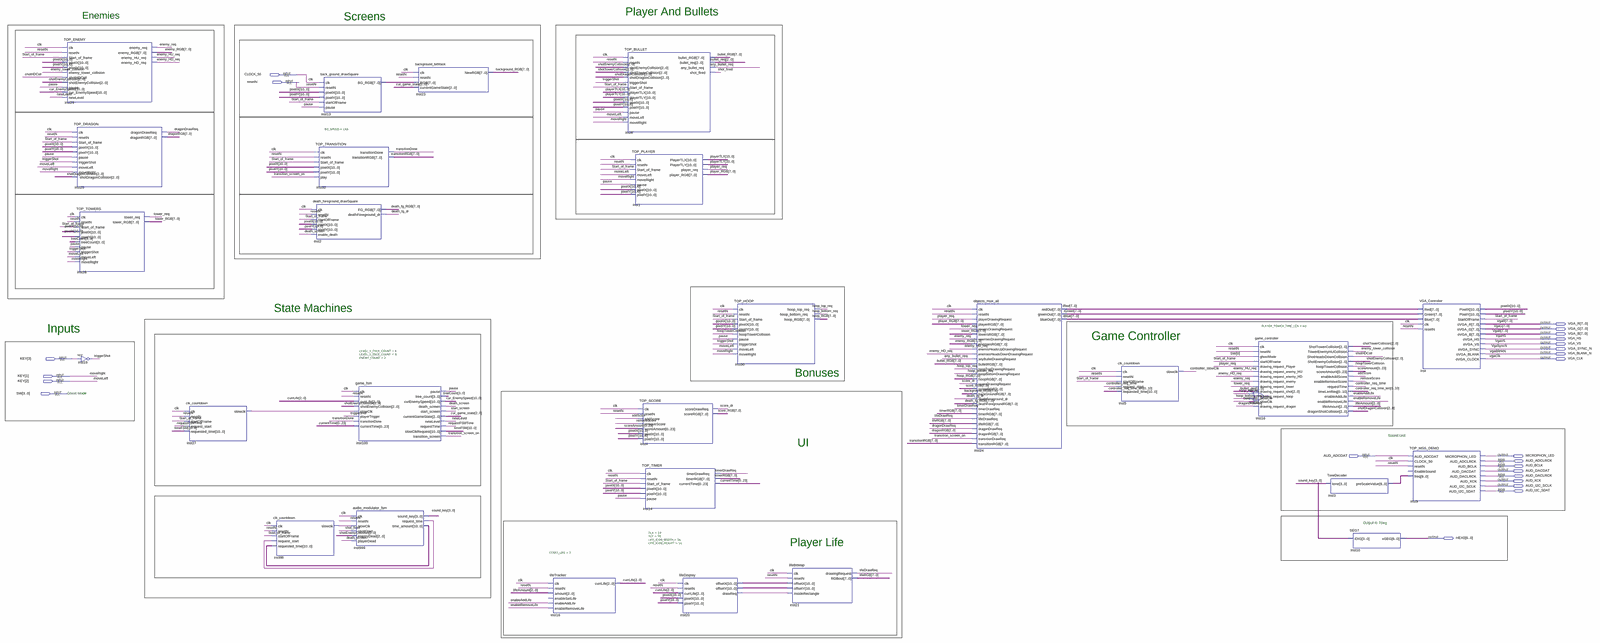
[diagram p0: schematic sheet, whole]
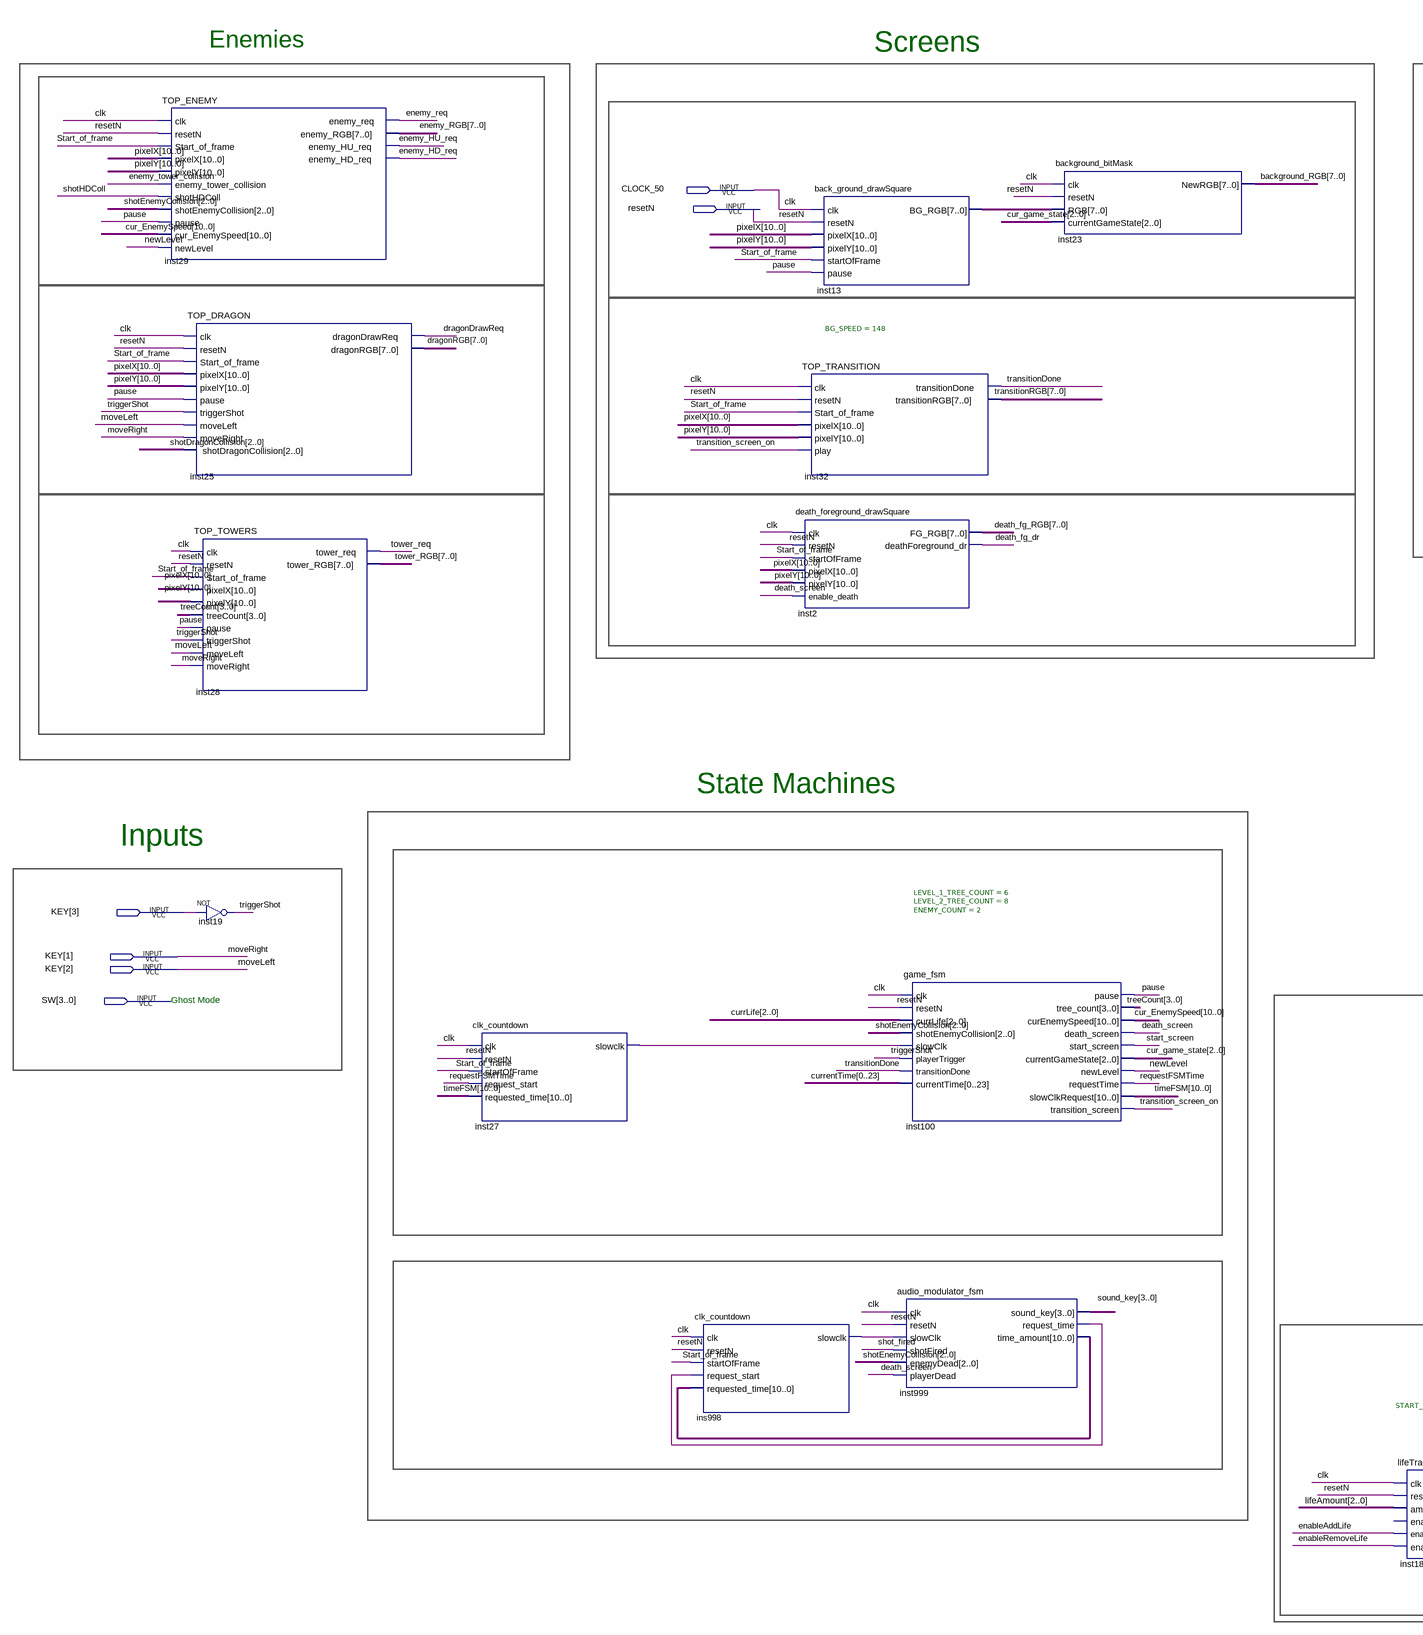
[diagram p1: schematic sheet, left part]
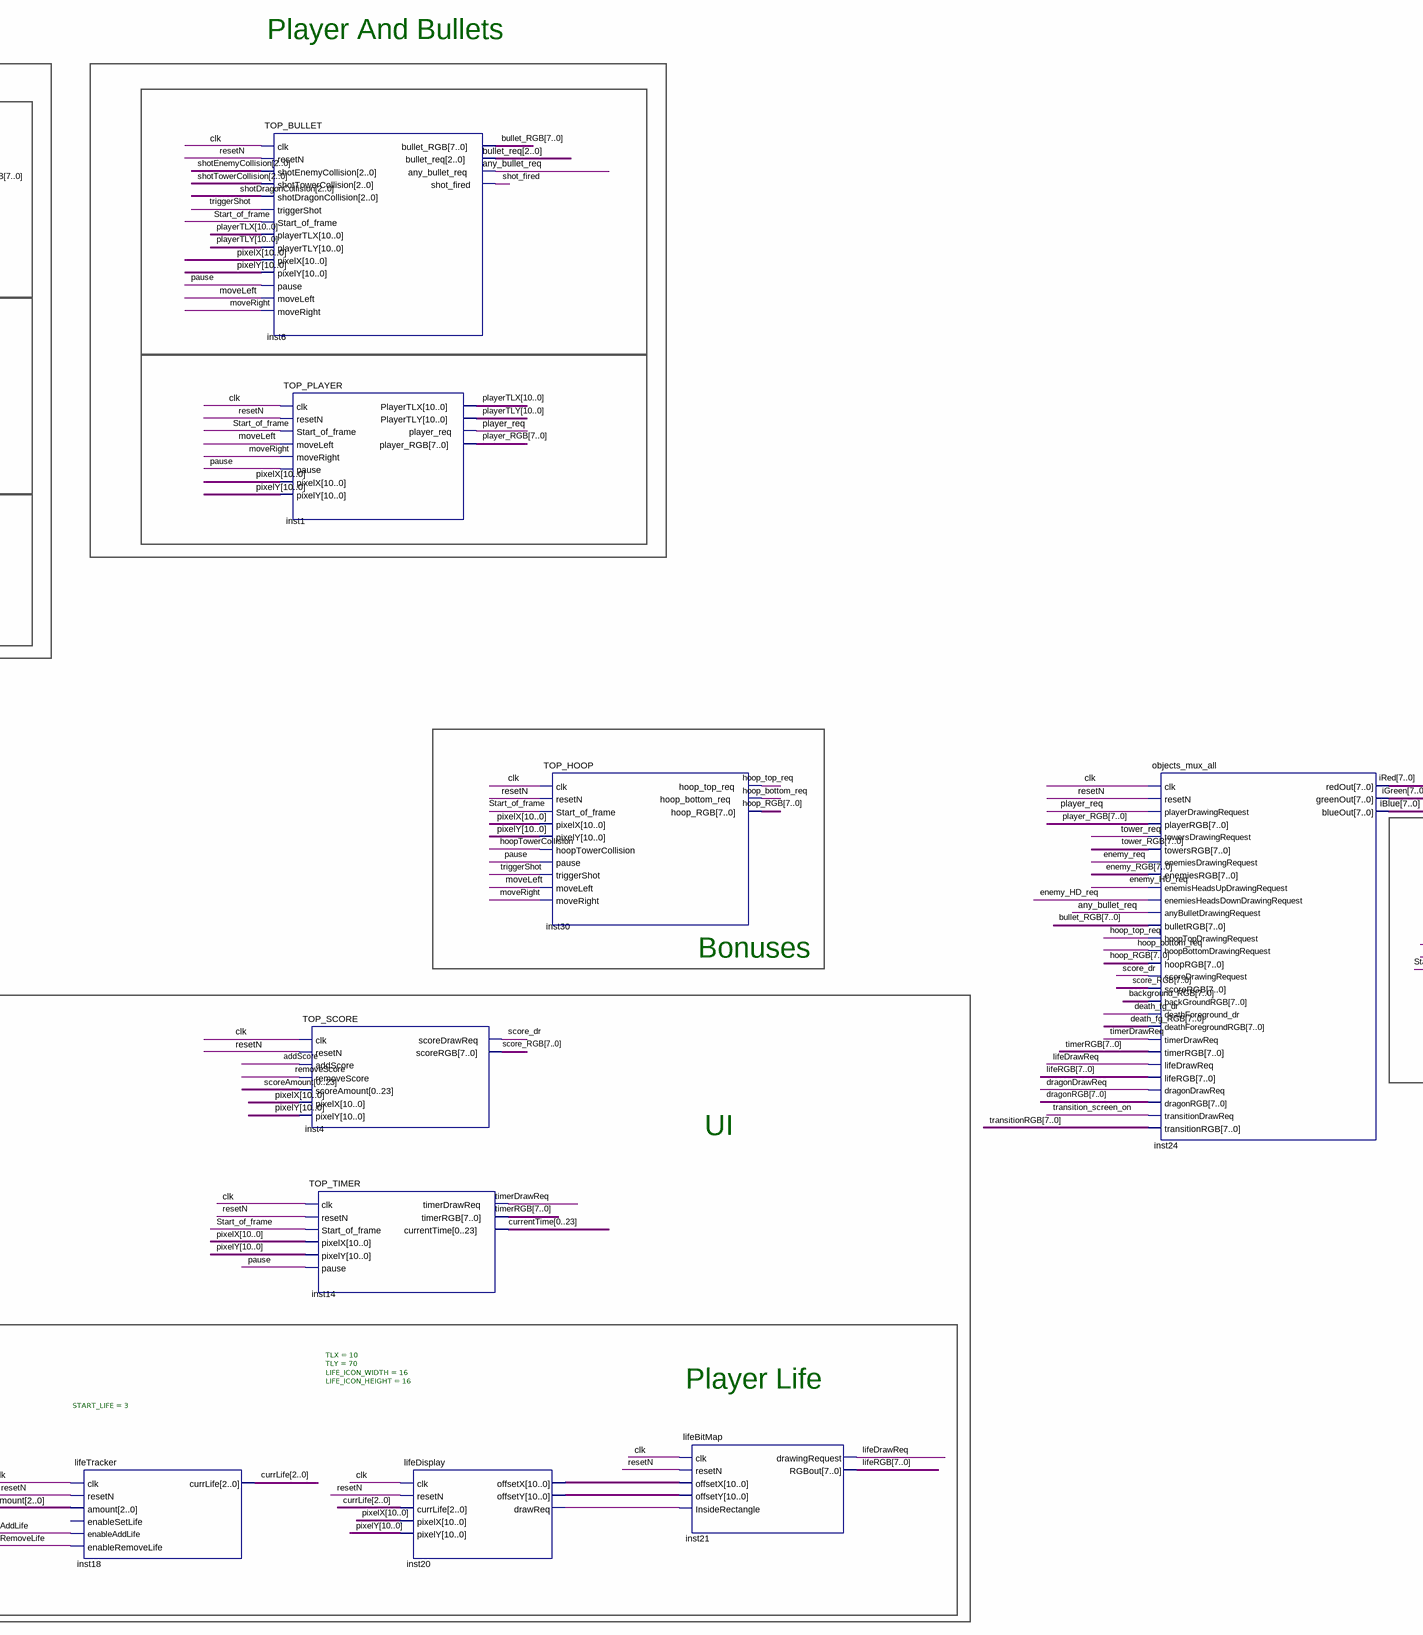
[diagram p2: schematic sheet, centre part]
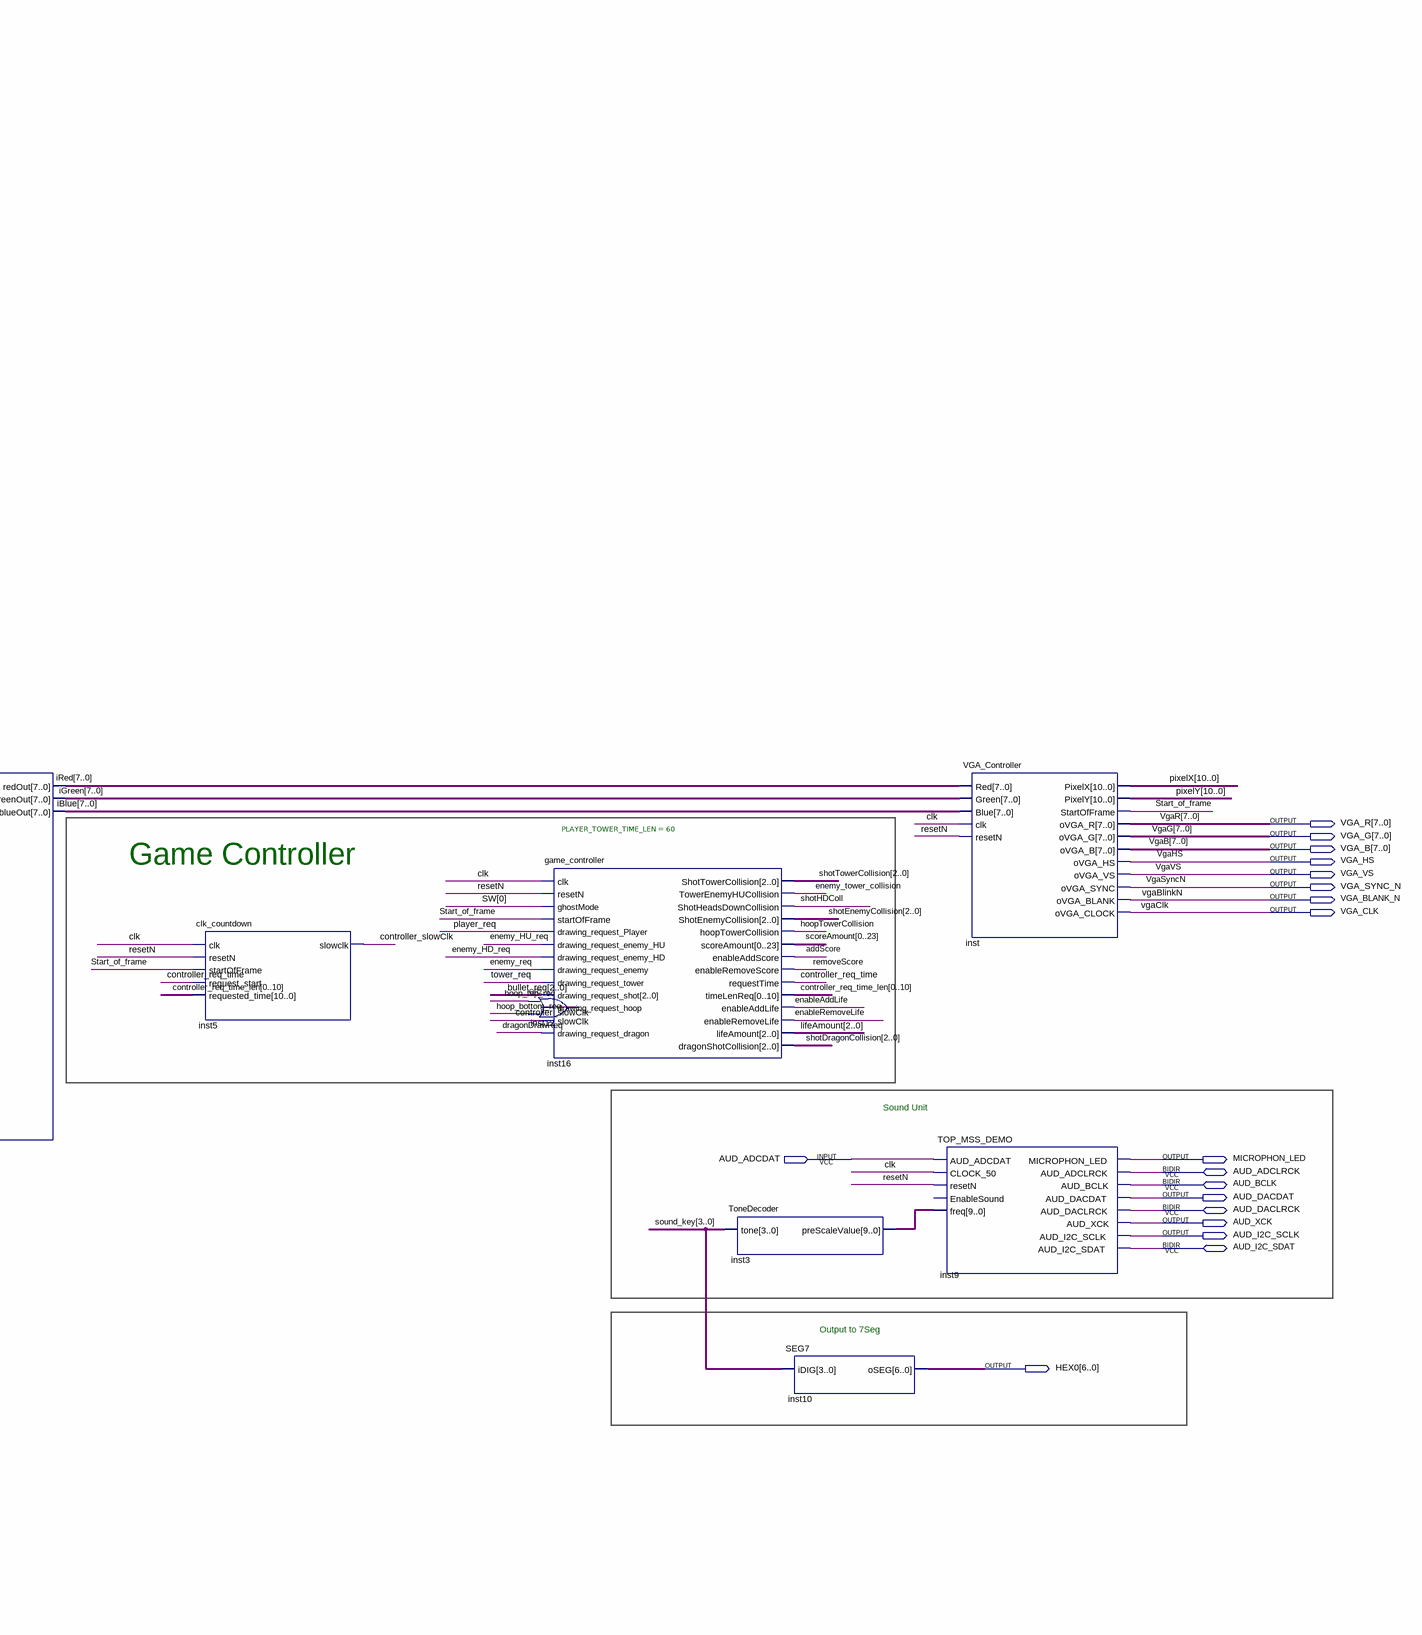
[diagram p3: schematic sheet, right part]
// Quartus schematic TOP_VGA_DEMO_WITH_MSS_ALL.bdf as structural Verilog: 28 symbols, 24 pins
module TOP_VGA_DEMO_WITH_MSS_ALL (
  input  CLOCK_50,
  input  resetN,
  input  [3:1] KEY,
  input  [3:0] SW,
  input  AUD_ADCDAT,
  inout  AUD_ADCLRCK,
  inout  AUD_BCLK,
  inout  AUD_DACLRCK,
  inout  AUD_I2C_SDAT,
  output [7:0] VGA_R,
  output [7:0] VGA_G,
  output [7:0] VGA_B,
  output VGA_HS,
  output VGA_VS,
  output VGA_SYNC_N,
  output VGA_BLANK_N,
  output VGA_CLK,
  output MICROPHON_LED,
  output AUD_DACDAT,
  output AUD_XCK,
  output AUD_I2C_SCLK,
  output [6:0] HEX0
);

  wire addScore, any_bullet_req, controller_req_time, controller_slowClk, death_fg_dr, death_screen,
       dragonDrawReq, enableAddLife, enableRemoveLife, enemy_HD_req, enemy_HU_req, enemy_req,
       enemy_tower_collision, hoop_bottom_req, hoop_top_req, hoopTowerCollision, ins998_slowclk, inst12_out,
       inst20_drawreq, inst27_slowclk, inst999_request_time, lifeDrawReq, newLevel, pause, player_req,
       removeScore, requestFSMTime, score_dr, shot_fired, shotHDColl, Start_of_frame, start_screen,
       timerDrawReq, tower_req, transition_screen_on, transitionDone, triggerShot;
  wire [2:0] bullet_req, cur_game_state, currLife, lifeAmount, shotDragonCollision, shotEnemyCollision,
       shotTowerCollision;
  wire [3:0] sound_key, treeCount;
  wire [7:0] background_RGB, bullet_RGB, death_fg_RGB, dragonRGB, enemy_RGB, hoop_RGB, iBlue, iGreen,
       inst13_bg_rgb, iRed, lifeRGB, player_RGB, score_RGB, timerRGB, tower_RGB, transitionRGB;
  wire [9:0] inst3_prescalevalue;
  wire [10:0] controller_req_time_len, cur_EnemySpeed, inst20_offsetx, inst20_offsety, inst999_time_amount,
       pixelX, pixelY, playerTLX, playerTLY, timeFSM;
  wire [23:0] currentTime, scoreAmount;

  TOP_ENEMY inst29 (
    .clk(CLOCK_50), .resetN(resetN), .Start_of_frame(Start_of_frame), .pixelX(pixelX), .pixelY(pixelY),
    .enemy_tower_collision(enemy_tower_collision), .shotHDColl(shotHDColl),
    .shotEnemyCollision(shotEnemyCollision), .pause(pause), .cur_EnemySpeed(cur_EnemySpeed),
    .newLevel(newLevel), .enemy_req(enemy_req), .enemy_RGB(enemy_RGB), .enemy_HU_req(enemy_HU_req),
    .enemy_HD_req(enemy_HD_req));
  TOP_DRAGON inst25 (
    .clk(CLOCK_50), .resetN(resetN), .Start_of_frame(Start_of_frame), .pixelX(pixelX), .pixelY(pixelY),
    .pause(pause), .triggerShot(triggerShot), .moveLeft(KEY[2]), .moveRight(KEY[1]),
    .shotDragonCollision(shotDragonCollision), .dragonDrawReq(dragonDrawReq), .dragonRGB(dragonRGB));
  TOP_TOWERS inst28 (
    .clk(CLOCK_50), .resetN(resetN), .Start_of_frame(Start_of_frame), .pixelX(pixelX), .pixelY(pixelY),
    .treeCount(treeCount), .pause(pause), .triggerShot(triggerShot), .moveLeft(KEY[2]), .moveRight(KEY[1]),
    .tower_req(tower_req), .tower_RGB(tower_RGB));
  not inst19 (triggerShot, KEY[3]);
  clk_countdown inst27 (
    .clk(CLOCK_50), .resetN(resetN), .startOfFrame(Start_of_frame), .request_start(requestFSMTime),
    .requested_time(timeFSM), .slowclk(inst27_slowclk));
  clk_countdown ins998 (
    .clk(CLOCK_50), .resetN(resetN), .startOfFrame(Start_of_frame), .request_start(inst999_request_time),
    .requested_time(inst999_time_amount), .slowclk(ins998_slowclk));
  back_ground_drawSquare #(.BG_SPEED(148)) inst13 (
    .clk(CLOCK_50), .resetN(resetN), .pixelX(pixelX), .pixelY(pixelY), .startOfFrame(Start_of_frame),
    .pause(pause), .BG_RGB(inst13_bg_rgb));
  TOP_TRANSITION inst32 (
    .clk(CLOCK_50), .resetN(resetN), .Start_of_frame(Start_of_frame), .pixelX(pixelX), .pixelY(pixelY),
    .play(transition_screen_on), .transitionDone(transitionDone), .transitionRGB(transitionRGB));
  death_foreground_drawSquare inst2 (
    .clk(CLOCK_50), .resetN(resetN), .startOfFrame(Start_of_frame), .pixelX(pixelX), .pixelY(pixelY),
    .enable_death(death_screen), .FG_RGB(death_fg_RGB), .deathForeground_dr(death_fg_dr));
  game_fsm #(.LEVEL_1_TREE_COUNT(6), .LEVEL_2_TREE_COUNT(8), .ENEMY_COUNT(2)) inst100 (
    .clk(CLOCK_50), .resetN(resetN), .currLife(currLife), .shotEnemyCollision(shotEnemyCollision),
    .slowClk(inst27_slowclk), .playerTrigger(triggerShot), .transitionDone(transitionDone),
    .currentTime({currentTime[0], currentTime[1], currentTime[2], currentTime[3], currentTime[4], currentTime[5], currentTime[6], currentTime[7], currentTime[8], currentTime[9], currentTime[10], currentTime[11], currentTime[12], currentTime[13], currentTime[14], currentTime[15], currentTime[16], currentTime[17], currentTime[18], currentTime[19], currentTime[20], currentTime[21], currentTime[22], currentTime[23]}),
    .pause(pause), .tree_count(treeCount), .curEnemySpeed(cur_EnemySpeed), .death_screen(death_screen),
    .start_screen(start_screen), .currentGameState(cur_game_state), .newLevel(newLevel),
    .requestTime(requestFSMTime), .slowClkRequest(timeFSM), .transition_screen(transition_screen_on));
  audio_modulator_fsm inst999 (
    .clk(CLOCK_50), .resetN(resetN), .slowClk(ins998_slowclk), .shotFired(shot_fired),
    .enemyDead(shotEnemyCollision), .playerDead(death_screen), .sound_key(sound_key),
    .request_time(inst999_request_time), .time_amount(inst999_time_amount));
  background_bitMask inst23 (
    .clk(CLOCK_50), .resetN(resetN), .RGB(inst13_bg_rgb), .currentGameState(cur_game_state),
    .NewRGB(background_RGB));
  lifeTracker #(.START_LIFE(3)) inst18 (
    .clk(CLOCK_50), .resetN(resetN), .amount(lifeAmount), .enableAddLife(enableAddLife),
    .enableRemoveLife(enableRemoveLife), .currLife(currLife));  // open: enableSetLife
  TOP_BULLET inst6 (
    .clk(CLOCK_50), .resetN(resetN), .shotEnemyCollision(shotEnemyCollision),
    .shotTowerCollision(shotTowerCollision), .shotDragonCollision(shotDragonCollision),
    .triggerShot(triggerShot), .Start_of_frame(Start_of_frame), .playerTLX(playerTLX), .playerTLY(playerTLY),
    .pixelX(pixelX), .pixelY(pixelY), .pause(pause), .moveLeft(KEY[2]), .moveRight(KEY[1]),
    .bullet_RGB(bullet_RGB), .bullet_req(bullet_req), .any_bullet_req(any_bullet_req), .shot_fired(shot_fired));
  TOP_PLAYER inst1 (
    .clk(CLOCK_50), .resetN(resetN), .Start_of_frame(Start_of_frame), .moveLeft(KEY[2]), .moveRight(KEY[1]),
    .pause(pause), .pixelX(pixelX), .pixelY(pixelY), .PlayerTLX(playerTLX), .PlayerTLY(playerTLY),
    .player_req(player_req), .player_RGB(player_RGB));
  TOP_SCORE inst4 (
    .clk(CLOCK_50), .resetN(resetN), .addScore(addScore), .removeScore(removeScore),
    .scoreAmount({scoreAmount[0], scoreAmount[1], scoreAmount[2], scoreAmount[3], scoreAmount[4], scoreAmount[5], scoreAmount[6], scoreAmount[7], scoreAmount[8], scoreAmount[9], scoreAmount[10], scoreAmount[11], scoreAmount[12], scoreAmount[13], scoreAmount[14], scoreAmount[15], scoreAmount[16], scoreAmount[17], scoreAmount[18], scoreAmount[19], scoreAmount[20], scoreAmount[21], scoreAmount[22], scoreAmount[23]}),
    .pixelX(pixelX), .pixelY(pixelY), .scoreDrawReq(score_dr), .scoreRGB(score_RGB));
  TOP_TIMER inst14 (
    .clk(CLOCK_50), .resetN(resetN), .Start_of_frame(Start_of_frame), .pixelX(pixelX), .pixelY(pixelY),
    .pause(pause), .timerDrawReq(timerDrawReq), .timerRGB(timerRGB),
    .currentTime({currentTime[0], currentTime[1], currentTime[2], currentTime[3], currentTime[4], currentTime[5], currentTime[6], currentTime[7], currentTime[8], currentTime[9], currentTime[10], currentTime[11], currentTime[12], currentTime[13], currentTime[14], currentTime[15], currentTime[16], currentTime[17], currentTime[18], currentTime[19], currentTime[20], currentTime[21], currentTime[22], currentTime[23]}));
  lifeDisplay #(.TLX(10), .TLY(70), .LIFE_ICON_WIDTH(16), .LIFE_ICON_HEIGHT(16)) inst20 (
    .clk(CLOCK_50), .resetN(resetN), .currLife(currLife), .pixelX(pixelX), .pixelY(pixelY),
    .offsetX(inst20_offsetx), .offsetY(inst20_offsety), .drawReq(inst20_drawreq));
  TOP_HOOP inst30 (
    .clk(CLOCK_50), .resetN(resetN), .Start_of_frame(Start_of_frame), .pixelX(pixelX), .pixelY(pixelY),
    .hoopTowerCollision(hoopTowerCollision), .pause(pause), .triggerShot(triggerShot), .moveLeft(KEY[2]),
    .moveRight(KEY[1]), .hoop_top_req(hoop_top_req), .hoop_bottom_req(hoop_bottom_req), .hoop_RGB(hoop_RGB));
  lifeBitMap inst21 (
    .clk(CLOCK_50), .resetN(resetN), .offsetX(inst20_offsetx), .offsetY(inst20_offsety),
    .InsideRectangle(inst20_drawreq), .drawingRequest(lifeDrawReq), .RGBout(lifeRGB));
  objects_mux_all inst24 (
    .clk(CLOCK_50), .resetN(resetN), .playerDrawingRequest(player_req), .playerRGB(player_RGB),
    .towersDrawingRequest(tower_req), .towersRGB(tower_RGB), .enemiesDrawingRequest(enemy_req),
    .enemiesRGB(enemy_RGB), .enemisHeadsUpDrawingRequest(enemy_HU_req),
    .enemiesHeadsDownDrawingRequest(enemy_HD_req), .anyBulletDrawingRequest(any_bullet_req),
    .bulletRGB(bullet_RGB), .hoopTopDrawingRequest(hoop_top_req), .hoopBottomDrawingRequest(hoop_bottom_req),
    .hoopRGB(hoop_RGB), .scoreDrawingRequest(score_dr), .scoreRGB(score_RGB), .backGroundRGB(background_RGB),
    .deathForeground_dr(death_fg_dr), .deathForegroundRGB(death_fg_RGB), .timerDrawReq(timerDrawReq),
    .timerRGB(timerRGB), .lifeDrawReq(lifeDrawReq), .lifeRGB(lifeRGB), .dragonDrawReq(dragonDrawReq),
    .dragonRGB(dragonRGB), .transitionDrawReq(transition_screen_on), .transitionRGB(transitionRGB),
    .redOut(iRed), .greenOut(iGreen), .blueOut(iBlue));
  clk_countdown inst5 (
    .clk(CLOCK_50), .resetN(resetN), .startOfFrame(Start_of_frame), .request_start(controller_req_time),
    .requested_time({controller_req_time_len[0], controller_req_time_len[1], controller_req_time_len[2], controller_req_time_len[3], controller_req_time_len[4], controller_req_time_len[5], controller_req_time_len[6], controller_req_time_len[7], controller_req_time_len[8], controller_req_time_len[9], controller_req_time_len[10]}),
    .slowclk(controller_slowClk));
  game_controller #(.PLAYER_TOWER_TIME_LEN(60)) inst16 (
    .clk(CLOCK_50), .resetN(resetN), .ghostMode(SW[0]), .startOfFrame(Start_of_frame),
    .drawing_request_Player(player_req), .drawing_request_enemy_HU(enemy_HU_req),
    .drawing_request_enemy_HD(enemy_HD_req), .drawing_request_enemy(enemy_req),
    .drawing_request_tower(tower_req), .drawing_request_shot(bullet_req), .drawing_request_hoop(inst12_out),
    .slowClk(controller_slowClk), .drawing_request_dragon(dragonDrawReq),
    .ShotTowerCollision(shotTowerCollision), .TowerEnemyHUCollision(enemy_tower_collision),
    .ShotHeadsDownCollision(shotHDColl), .ShotEnemyCollision(shotEnemyCollision),
    .hoopTowerCollision(hoopTowerCollision),
    .scoreAmount({scoreAmount[0], scoreAmount[1], scoreAmount[2], scoreAmount[3], scoreAmount[4], scoreAmount[5], scoreAmount[6], scoreAmount[7], scoreAmount[8], scoreAmount[9], scoreAmount[10], scoreAmount[11], scoreAmount[12], scoreAmount[13], scoreAmount[14], scoreAmount[15], scoreAmount[16], scoreAmount[17], scoreAmount[18], scoreAmount[19], scoreAmount[20], scoreAmount[21], scoreAmount[22], scoreAmount[23]}),
    .enableAddScore(addScore), .enableRemoveScore(removeScore), .requestTime(controller_req_time),
    .timeLenReq({controller_req_time_len[0], controller_req_time_len[1], controller_req_time_len[2], controller_req_time_len[3], controller_req_time_len[4], controller_req_time_len[5], controller_req_time_len[6], controller_req_time_len[7], controller_req_time_len[8], controller_req_time_len[9], controller_req_time_len[10]}),
    .enableAddLife(enableAddLife), .enableRemoveLife(enableRemoveLife), .lifeAmount(lifeAmount),
    .dragonShotCollision(shotDragonCollision));
  or inst12 (inst12_out, hoop_top_req, hoop_bottom_req);
  ToneDecoder inst3 (.tone(sound_key), .preScaleValue(inst3_prescalevalue));
  SEG7 inst10 (.iDIG(sound_key), .oSEG(HEX0));
  VGA_Controller inst (
    .Red(iRed), .Green(iGreen), .Blue(iBlue), .clk(CLOCK_50), .resetN(resetN), .PixelX(pixelX),
    .PixelY(pixelY), .StartOfFrame(Start_of_frame), .oVGA_R(VGA_R), .oVGA_G(VGA_G), .oVGA_B(VGA_B),
    .oVGA_HS(VGA_HS), .oVGA_VS(VGA_VS), .oVGA_SYNC(VGA_SYNC_N), .oVGA_BLANK(VGA_BLANK_N), .oVGA_CLOCK(VGA_CLK));
  TOP_MSS_DEMO inst9 (
    .AUD_ADCDAT(AUD_ADCDAT), .CLOCK_50(CLOCK_50), .resetN(resetN), .freq(inst3_prescalevalue),
    .MICROPHON_LED(MICROPHON_LED), .AUD_DACDAT(AUD_DACDAT), .AUD_XCK(AUD_XCK), .AUD_I2C_SCLK(AUD_I2C_SCLK),
    .AUD_ADCLRCK(AUD_ADCLRCK), .AUD_BCLK(AUD_BCLK), .AUD_DACLRCK(AUD_DACLRCK), .AUD_I2C_SDAT(AUD_I2C_SDAT));  // open: EnableSound

  // Other names for the same wires on the sheet: clk = CLOCK_50; moveLeft = KEY[2]; moveRight = KEY[1];
  //   VgaB[7:0] = VGA_B; vgaBlinkN = VGA_BLANK_N; vgaClk = VGA_CLK; VgaG[7:0] = VGA_G; VgaHS = VGA_HS;
  //   VgaR[7:0] = VGA_R; VgaSyncN = VGA_SYNC_N; VgaVS = VGA_VS

  // Notes on the sheet:
  //   Player And Bullets
  //   Enemies
  //   Screens
  //   State Machines
  //   Inputs
  //   Game Controller
  //   Bonuses
  //   Ghost Mode
  //   Sound Unit
  //   UI
  //   Output to 7Seg
  //   Player Life
endmodule
